# EAGLE design ENC28J60[2] (EAGLE 9.5.2)
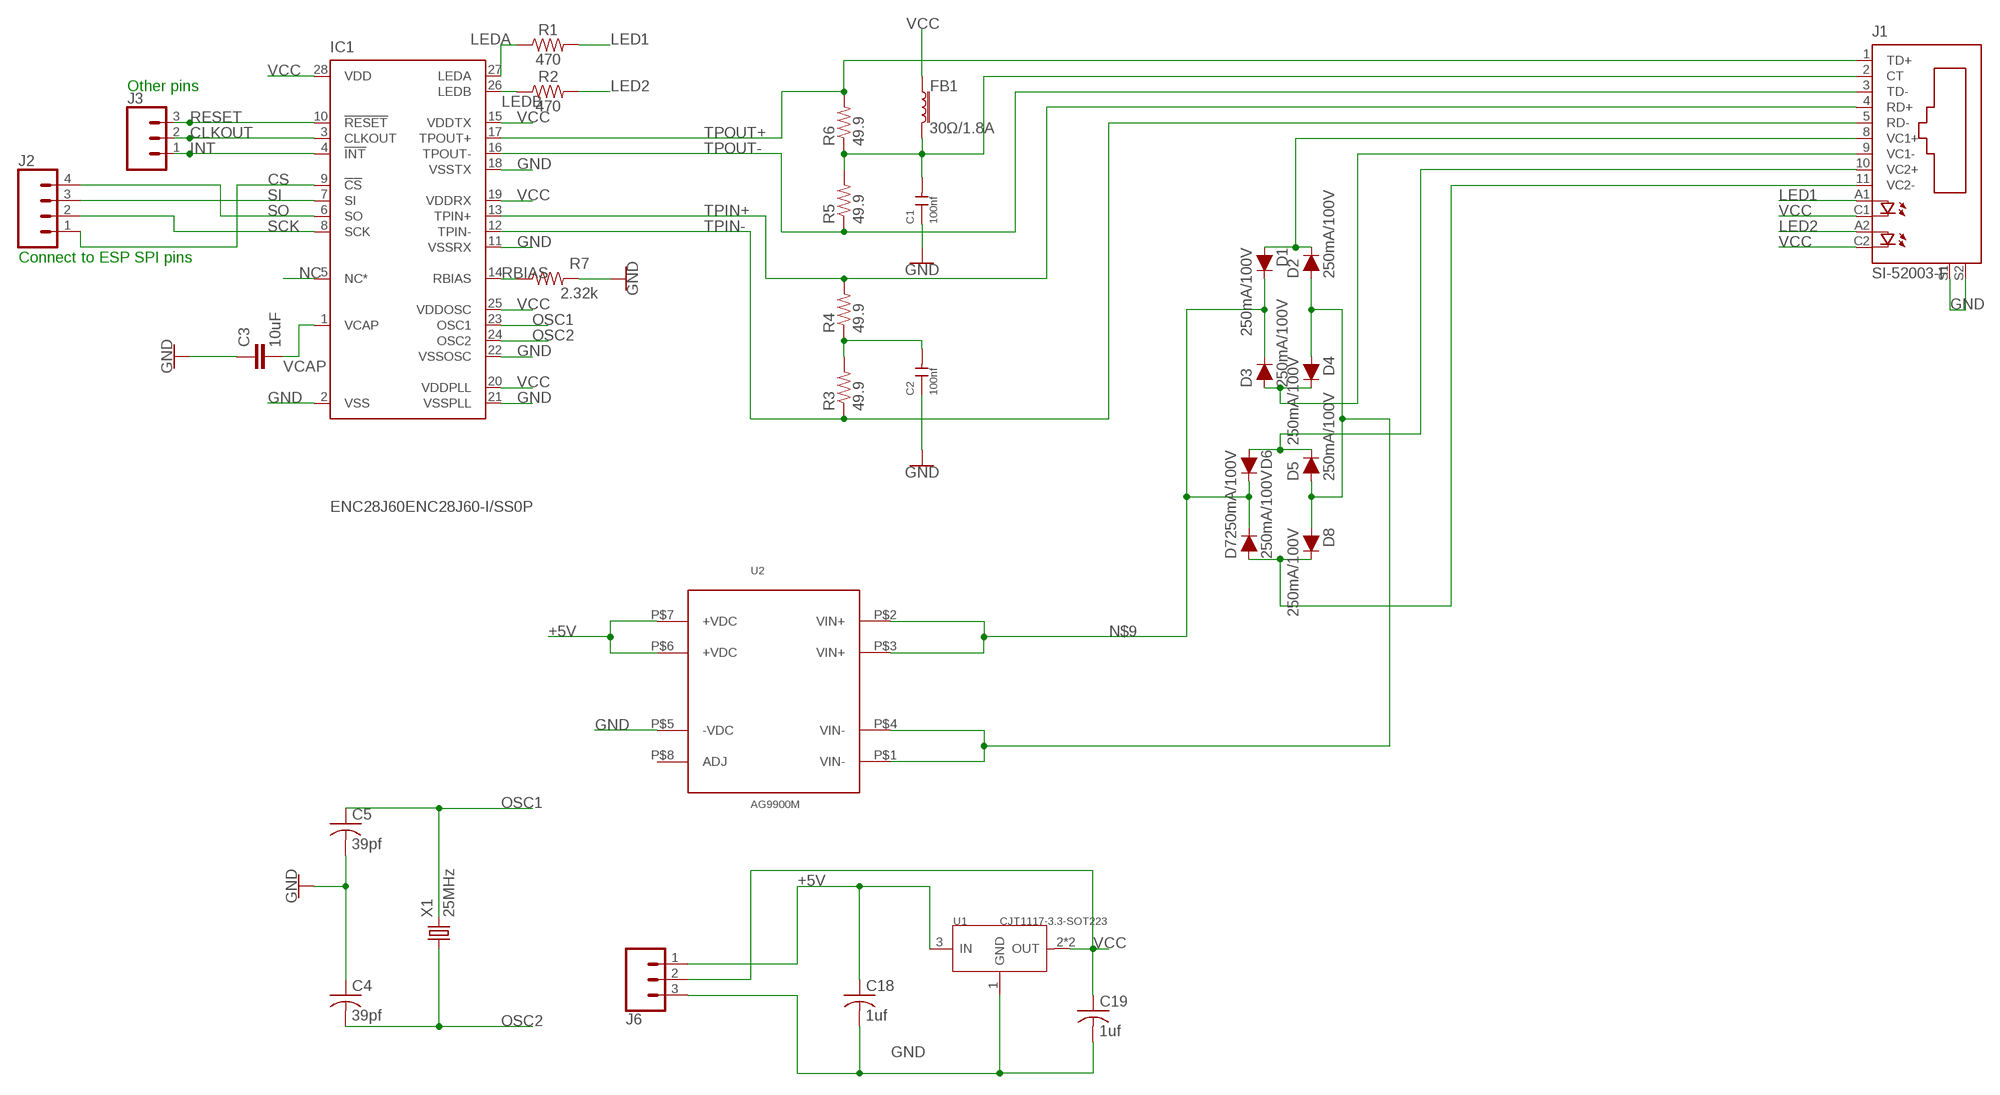
[diagram p0: schematic, sheet 1]

## Parts
C1  100nf  CERAMIC-100NF-50V-10%-X7R(0603)  [C0603]
C2  100nf  CERAMIC-100NF-50V-10%-X7R(0603)  [C0603]
C3  10uF  10UF-0805-10V-10%  [0805]
C4  39pf  C-USC0402  [C0402]
C5  39pf  C-USC0402  [C0402]
C18  1uf  C-USC0402  [C0402]
C19  1uf  C-USC0402  [C0402]
D1  250mA/100V  DIODE-BAS16J  [SOD-323]
D2  250mA/100V  DIODE-BAS16J  [SOD-323]
D3  250mA/100V  DIODE-BAS16J  [SOD-323]
D4  250mA/100V  DIODE-BAS16J  [SOD-323]
D5  250mA/100V  DIODE-BAS16J  [SOD-323]
D6  250mA/100V  DIODE-BAS16J  [SOD-323]
D7  250mA/100V  DIODE-BAS16J  [SOD-323]
D8  250mA/100V  DIODE-BAS16J  [SOD-323]
FB1  30Ω/1.8A  FERRITE_BEAD-0603  [0603]
IC1  ENC28J60ENC28J60-I/SS0P  [SOP65P780X200-28]
J1  SI-52003-F  [SI-52003-F]
J2  CONN_04  [1X04]
J3  CONN_03  [1X03]
J6  CONN_03  [1X03]
R1  470  470OHM-0603-1/10W-1%  [0603]
R2  470  470OHM-0603-1/10W-1%  [0603]
R3  49.9  R-US_M0805  [M0805]
R4  49.9  R-US_M0805  [M0805]
R5  49.9  R-US_M0805  [M0805]
R6  49.9  R-US_M0805  [M0805]
R7  2.32k  2.2KOHM-0603-1/10W-1%  [0603]
U1  CJT1117-3.3-SOT223  PMIC-CJT1117-3.3(SOT223)  [SOT-223]
U2  AG9900M  [AG9900M/MT]
X1  25MHz  49S-25-20-2049S-25-20-20  [XTALRR488W48L1067T422H350B]

## Nets
+5V: C18.1 J6.1 U1.3(IN) U2.P$6(+VDC) U2.P$7(+VDC)
CLKOUT: IC1.3(CLKOUT) J3.2
CS: IC1.9(!CS) J2.1
GND: C1.1 C2.1 C3.1 C4.1 C5.2 C18.2 C19.2 IC1.2(VSS) IC1.11(VSSRX) IC1.18(VSSTX) IC1.21(VSSPLL) IC1.22(VSSOSC) J1.S1 J1.S2 J6.3 R7.2 U1.1(GND) U2.P$5(-VDC)
INT: IC1.4(!INT) J3.1
LED1: J1.A1 R1.2
LED2: J1.A2 R2.2
LEDA: IC1.27(LEDA) R1.1
LEDB: IC1.26(LEDB) R2.1
N$1: D3.A D4.C J1.9(VC1-)
N$2: D7.A D8.C J1.11(VC2-)
N$3: C1.2 FB1.2 J1.2(CT) R5.2 R6.1
N$7: D1.A D2.C J1.8(VC1+)
N$9: D1.C D3.C D6.C D7.C U2.P$2(VIN+) U2.P$3(VIN+)
N$15: D5.C D6.A J1.10(VC2+)
N$18: C2.2 R3.2 R4.1
N$39: D2.A D4.A D5.A D8.A U2.P$1(VIN-) U2.P$4(VIN-)
NC: IC1.5(NC*)
OSC1: C5.1 IC1.23(OSC1) X1.2
OSC2: C4.2 IC1.24(OSC2) X1.1
RBIAS: IC1.14(RBIAS) R7.1
RESET: IC1.10(!RESET) J3.3
SCK: IC1.8(SCK) J2.2
SI: IC1.7(SI) J2.3
SO: IC1.6(SO) J2.4
TPIN+: IC1.13(TPIN+) J1.4(RD+) R4.2
TPIN-: IC1.12(TPIN-) J1.5(RD-) R3.1
TPOUT+: IC1.17(TPOUT+) J1.1(TD+) R6.2
TPOUT-: IC1.16(TPOUT-) J1.3(TD-) R5.1
VCAP: C3.2 IC1.1(VCAP)
VCC: C19.1 FB1.1 IC1.15(VDDTX) IC1.19(VDDRX) IC1.20(VDDPLL) IC1.25(VDDOSC) IC1.28(VDD) J1.C1 J1.C2 J6.2 U1.2(OUT) U1.TER(OUT)
Unconnected: U2.P$8(ADJ)

## Notes on the sheet
- Other pins
- Connect to ESP SPI pins

## Library data of the parts
C1 C2 = OPL_Capacitor:CERAMIC-100NF-50V-10%-X7R(0603): 302010138; MPN: CC0603KRX7R9BB104
C3 = SparkFun-Capacitors:10UF: 10.0µF ceramic capacitors A capacitor is a passive two-terminal electrical component used to store electrical energy temporarily in an electric field.; PROD_ID: CAP-11330
C4 C5 C18 C19 = BeagleBone_Black_Wireless:C-US: CAPACITOR, American symbol
D1-D8 = SparkFun-DiscreteSemi:DIODE: Diode These are standard reverse protection diodes and small signal diodes. SparkFun Products: SparkFun SparkPunk Sound Kit <https://www.sparkfun.com/products/11177> SparkFun ESP8266 Thing <https://www.sparkfun.com/products/13231>; PROD_ID: DIO-09646
FB1 = SparkFun-Coils:FERRITE_BEAD: Ferrite Bead (blocks, cores, rings, chokes, etc.) Inductor with layers of ferrite used to suppress high frequencies. Often used to isolate high frequency noise. SparkFun Products: IOIO-OTG - V2.2 <https://www.sparkfun.com/products/13613> SparkFun SAMD21 Mini Breakout <https://www.sparkfun.com/products/13664> SparkFun 6 Degrees of Freedom Breakout - LSM6DS3 <https://www.sparkfun.com/products/13339> SparkFun SAMD21 Dev Breakout <https://www.sparkfun.com/products/13672>; PROD_ID: NDUC-07859
IC1 = ENC28J60QFN:ENC28J60: Stand-Alone Ethernet Controller with SPI Interface Source: http://ww1.microchip.com/downloads/en/DeviceDoc/39662c.pdf
J1 = SI-52003-F:SI-52003-F: Ethernet Connector MagJack (R) Source: www.stewartconnector.com .. si-50170.pdf; AVAILABILITY: Unavailable; DESCRIPTION: Conn RJ-45 F 8 POS Solder RA Thru-Hole 12 Terminal 1 Port; MF: Stewart Connector; MP: SI-52003-F; PACKAGE: None; PRICE: None
J2 = SparkFun-Connectors:CONN_04: Multi connection point. Often used as Generic Header-pin footprint for 0.1 inch spaced/style header connections On any of the 0.1 inch spaced packages, you can populate with these: Break Away Headers - Straight <https://www.sparkfun.com/products/116> (PRT-00116) Break Away Male Headers - Right Angle <https://www.sparkfun.com/products/553> (PRT-00553) Female Headers <https://www.sparkfun.com/products/115> (PRT-00115) Break Away Headers - Machine Pin <https://www.sparkfun.com/products/117> (PRT-00117) Break Away Female Headers - Swiss Machine Pin <https://www.sparkfun.com/products/743> (PRT-00743) For SCREWTERMINALS and SPRING TERMINALS visit here: Screw Terimnals on SparkFun.com <https://www.sparkfun.com/search/results?term=Screw+Terminals> (5mm/3.5mm/2.54mm spacing) This device is also useful as a general connection point to wire up your design to another part of your project. Our various solder wires solder well into these plated through hole pads. Hook-Up Wire - Assortment (Stranded, 22 AWG) <https://www.sparkfun.com/products/11375> (PRT-11375) Hook-Up Wire - Assortment (Solid Core, 22 AWG) <https://www.sparkfun.com/products/11367> (PRT-11367) View the entire wire category on our website here <https://www.sparkfun.com/categories/141> Special notes: Molex polarized connector foot print use with SKU : PRT-08231 with associated crimp pins and housings. 1MM SMD Version SKU: PRT-10208; PROD_ID: CONN-09696
J3 J6 = SparkFun-Connectors:CONN_03: Multi connection point. Often used as Generic Header-pin footprint for 0.1 inch spaced/style header connections On any of the 0.1 inch spaced packages, you can populate with these: Break Away Headers - Straight <https://www.sparkfun.com/products/116> (PRT-00116) Break Away Male Headers - Right Angle <https://www.sparkfun.com/products/553> (PRT-00553) Female Headers <https://www.sparkfun.com/products/115> (PRT-00115) Break Away Headers - Machine Pin <https://www.sparkfun.com/products/117> (PRT-00117) Break Away Female Headers - Swiss Machine Pin <https://www.sparkfun.com/products/743> (PRT-00743) Stackable Header - 3 Pin (Female, 0.1") <https://www.sparkfun.com/products/13875> (PRT-13875) For SCREWTERMINALS and SPRING TERMINALS visit here: Screw Terimnals on SparkFun.com <https://www.sparkfun.com/search/results?term=Screw+Terminals> (5mm/3.5mm/2.54mm spacing) This device is also useful as a general connection point to wire up your design to another part of your project. Our various solder wires solder well into these plated through hole pads. Hook-Up Wire - Assortment (Stranded, 22 AWG) <https://www.sparkfun.com/products/11375> (PRT-11375) Hook-Up Wire - Assortment (Solid Core, 22 AWG) <https://www.sparkfun.com/products/11367> (PRT-11367) View the entire wire category on our website here <https://www.sparkfun.com/categories/141> Special notes: Molex polarized connector foot print use with SKU : PRT-08232 with associated crimp pins and housings.
R1 R2 = SparkFun-Resistors:470OHM: 470Ω resistor A resistor is a passive two-terminal electrical component that implements electrical resistance as a circuit element. Resistors act to reduce current flow, and, at the same time, act to lower voltage levels within circuits. - Wikipedia; PROD_ID: RES-07869
R3-R6 = BeagleBone_Black_Wireless:R-US_: RESISTOR, American symbol
R7 = SparkFun-Resistors:2.2KOHM: 2.2kΩ resistor A resistor is a passive two-terminal electrical component that implements electrical resistance as a circuit element. Resistors act to reduce current flow, and, at the same time, act to lower voltage levels within circuits. - Wikipedia; PROD_ID: RES-08272; VALUE: 2.2k
U1 = OPL_IC:PMIC-CJT1117-3.3(SOT223): 310030097; MPN: CJT1117-3.3
U2 = AG9900M:AG9900M
X1 = IQD-Frequency-Products:49S-25-20-20

## Board
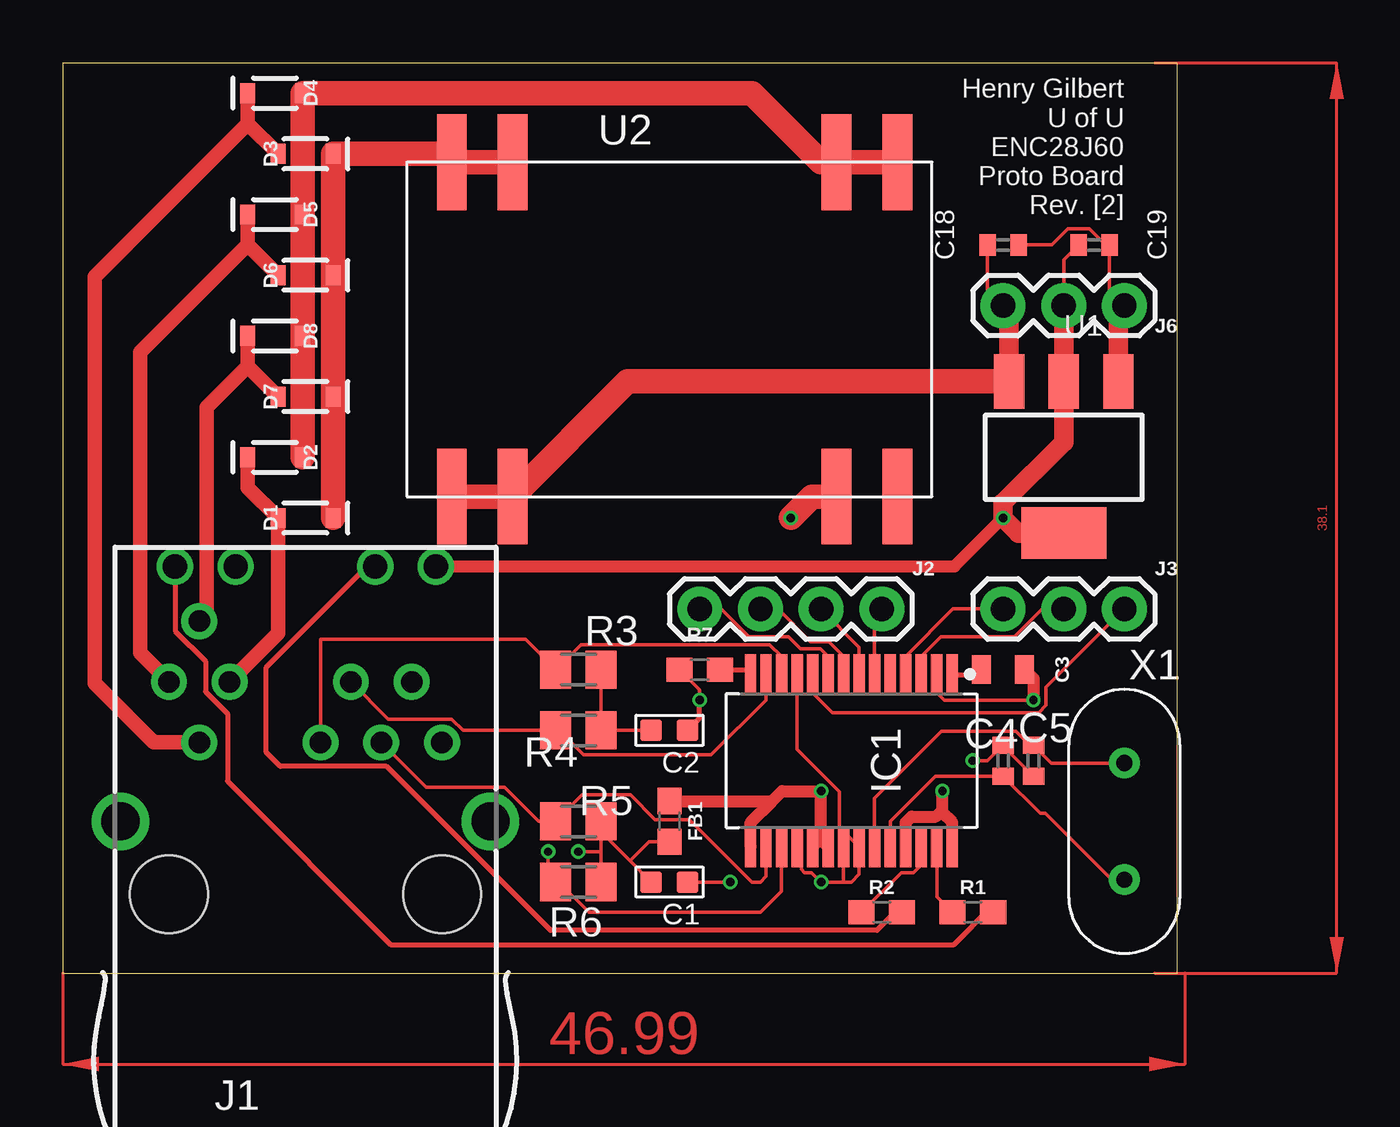
[diagram p1: board, top side]
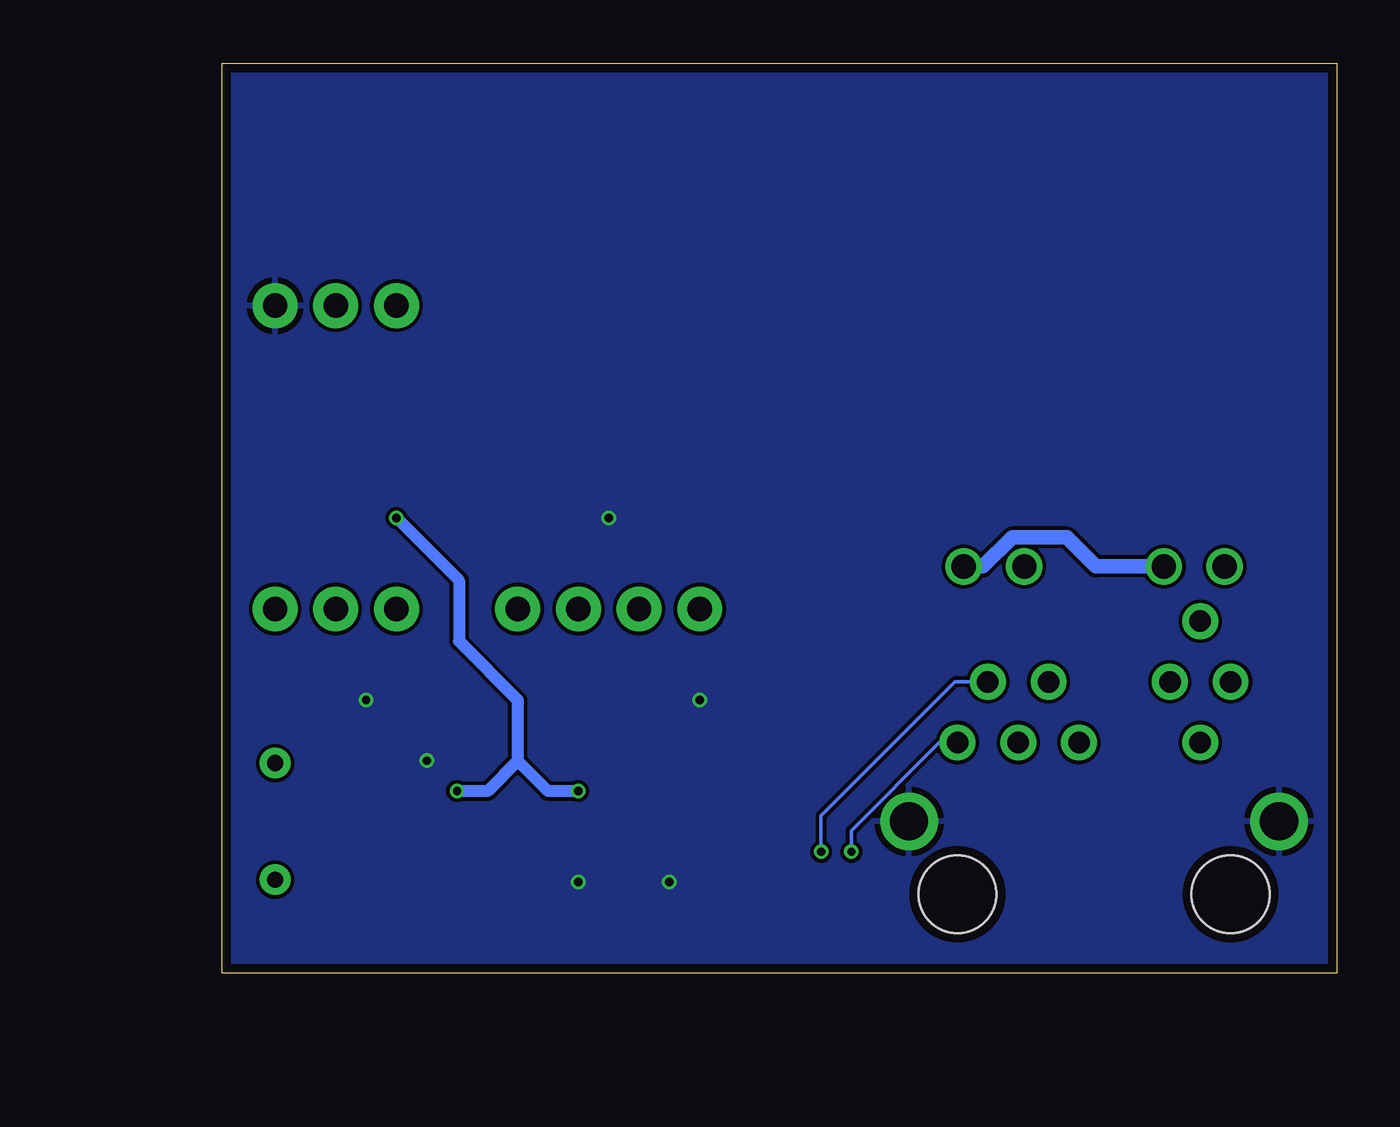
[diagram p2: board, bottom side, seen from below]

Size 46.66 x 38.09 mm. Coordinates in mm from the lower left corner, seen from the top.
Outline: 0,0 46.66,0 46.66,38.09 0,38.09 0,0
Copper layers (1*16): Top 0.035559375mm / dielectric 1.6mm / Bottom 0.035559375mm
Design rules "oshpark": minimum track width 6mil, minimum drill 10mil, track to track 6mil, track to pad 6mil, pad to pad 6mil, via to via 6mil, smd to smd 6mil, copper to edge 15mil, drill to drill 6mil, minimum pad ring 5mil, minimum via ring 5mil, stop-mask expansion 2.5mil, vias tented up to drill 0mil, thermal gap 10mil

### Footprints (pad centres in the part's own frame; a part is rotated, then mirrored left to right if it is on the bottom)
C0603 = smd 0.889 x 0.889: 1 0,0.762; 2 0,-0.762
0805 = smd 0.8 x 1.2: 1 -0.9,0; 2 0.9,0
C0402 = smd 0.7 x 0.9: 1 -0.65,0; 2 0.65,0
SOD-323 = smd 0.63 x 0.83: A 1.15,0; C -1.15,0
0603 = smd 1.1 x 1: 1 -0.85,0; 2 0.85,0
SOP65P780X200-28 = smd 1.702 x 0.475: 1 -3.603,4.225; 2 -3.603,3.575; 3 -3.603,2.925; 4 -3.603,2.275; 5 -3.603,1.625; 6 -3.603,0.975; 7 -3.603,0.325; 8 -3.603,-0.325; 9 -3.603,-0.975; 10 -3.603,-1.625; 11 -3.603,-2.275; 12 -3.603,-2.925; 13 -3.603,-3.575; 14 -3.603,-4.225; 15 3.603,-4.225; 16 3.603,-3.575; 17 3.603,-2.925; 18 3.603,-2.275; 19 3.603,-1.625; 20 3.603,-0.975; 21 3.603,-0.325; 22 3.603,0.325; 23 3.603,0.975; 24 3.603,1.625; 25 3.603,2.275; 26 3.603,2.925; 27 3.603,3.575; 28 3.603,4.225
SI-52003-F = drill 0.9 pad 1.5: 1 5.715,3.302; 2 4.445,5.842; 3 3.175,3.302; 4 1.905,5.842; 5 0.635,3.302; 8 -3.175,5.842; 9 -4.445,3.302; 10 -5.715,5.842; 11 -4.445,8.382 | drill 1.016 pad 1.5: A1 -5.461,10.668; A2 2.921,10.668; C1 -2.921,10.668; C2 5.461,10.668 | drill 1.6 pad 2.2: S1 -7.747,0; S2 7.747,0 | hole 3.251: -5.715,-3.048; 5.715,-3.048
1X04 = drill 1.016 pad 1.88: 1 0,0; 2 2.54,0; 3 5.08,0; 4 7.62,0
1X03 = drill 1.016 pad 1.88: 1 0,0; 2 2.54,0; 3 5.08,0
M0805 = smd 1.3 x 1.6: 1 -0.95,0; 2 0.95,0
SOT-223 = smd 1.27 x 2.286: 1 -2.286,-3.175; 2 0,-3.175; 3 2.286,-3.175 | smd 3.556 x 2.159: TER 0,3.175
AG9900M/MT = smd 1.25 x 4: P$1 7,6; P$2 -6.57,6; P$3 -9.11,6; P$4 9.54,6; P$5 7,-8; P$6 -6.57,-8; P$7 -9.11,-8; P$8 9.54,-8
XTALRR488W48L1067T422H350B = drill 0.68 pad 1.28: 1 -2.44,0; 2 2.44,0

### Placement (x,y rotation side)
C1  25.4,3.81 270 top
C2  25.4,10.16 270 top
C3  39.37,12.7 180 top
C4  39.37,8.89 270 top
C5  40.64,8.89 270 top
C18  39.37,30.48 0 top
C19  43.18,30.48 0 top
D1  10.16,19.05 180 top
D2  8.89,21.59 0 top
D3  10.16,34.29 180 top
D4  8.89,36.83 0 top
D5  8.89,31.75 0 top
D6  10.16,29.21 180 top
D7  10.16,24.13 180 top
D8  8.89,26.67 0 top
FB1  25.4,6.35 270 top
IC1  33.02,8.89 270 top
J1  10.16,6.35 0 top
J2  26.67,15.24 0 top
J3  39.37,15.24 0 top
J6  39.37,27.94 0 top
R1  38.1,2.54 0 top
R2  34.29,2.54 0 top
R3  21.59,12.7 0 top
R4  21.59,10.16 180 top
R5  21.59,6.35 0 top
R6  21.59,3.81 180 top
R7  26.67,12.7 180 top
U1  41.91,21.59 180 top
U2  25.4,27.94 0 top
X1  44.45,6.35 90 top

### Tracks (layer width: path | path; a pad name or v marks a point on that pad's centre or on a via)
+5V
  Top 0.152: J6.1 38.72,28.59 C18.1
  Top 0.813: U1.3 39.62,27.69 J6.1
  Top 1.016: U2.P$7 U2.P$6 23.66,24.77 U1.3
CLKOUT
  Top 0.152: J3.2 41.02,15.24 39.85,14.07 36.76,14.07 35.95,13.26 IC1.3
CS
  Top 0.152: J2.1 27.56,15.24 28.73,14.07 30.38,14.07 30.88,13.57 31.73,13.57 32.05,13.26 IC1.9
GND  (via drill 0.35)
  Top 0.152: v27.94,3.81 C1.1 | IC1.18 30.93,5.1 30.93,4.34 31.06,4.21 31.35,4.21 v31.75,3.81 32.7,3.81 | IC1.21 32.7,3.81 | 32.7,3.81 33.02,3.81 33.34,4.13 IC1.22 32.7,5.94 IC1.21 | C5.2 39.37,9.51 C4.1 38.72,8.89 v38.1,8.89 | R7.2 26.67,11.85 v26.67,11.43 | IC1.21 32.53,5.46 32.53,7.59 30.75,9.38 IC1.11 | v40.64,11.43 40.62,11.41 36.91,11.41 36.59,11.73 IC1.2 | C18.2 41.41,30.48 42.09,31.16 42.98,31.16 43.65,30.48 C19.2 43.83,28.56 J6.3
  Top 0.2: C2.1 26.67,10.67 v26.67,11.43
  Top 0.508: C3.1 40.64,12.33 v40.64,11.43
  Top 0.813: U1.1 44.2,27.69 J6.3
  Top 1.016: v30.48,19.05 31.37,19.94 U2.P$5
  pour Bottom: 0,38.1 46.99,38.1 46.99,0 0,0
INT
  Top 0.152: J3.1 37.28,15.24 35.3,13.26 IC1.4
LED1
  Top 0.152: R1.2 39.16,2.75
  Top 0.203: 39.16,2.75 38.87,2.75 37.31,1.19 13.73,1.19 6.89,8.03 6.89,10.86 5.98,11.78 5.98,13.05 4.71,14.32 4.71,17.01 J1.A1
LED2
  Top 0.203: R2.2 34.85,2.54 34.09,1.79 20.41,1.79 13.55,8.65 9.11,8.65 8.52,9.24 8.52,12.8 12.74,17.02 J1.A2
LEDA
  Top 0.152: R1.1 36.59,3.19 IC1.27
LEDB
  Top 0.152: R2.1 35.11,4.21 35.63,4.21 35.95,4.53 IC1.26
N$1
  Top 0.61: D3.A 7.74,35.56 | 7.74,35.56 D4.C | J1.9 3.81,9.65 1.33,12.13 1.33,29.15 7.74,35.56
N$2
  Top 0.61: D7.A 7.74,25.4 | D8.C 7.74,25.4 | J1.11 6.02,15.04 6.02,23.68 7.74,25.4
N$3  (via drill 0.35)
  Top 0.152: C1.2 23.75,4.7 | 23.75,4.7 22.54,5.91 R5.2 22.54,5.08 | 22.54,5.08 R6.1 | 22.54,5.08 v21.59,5.08 | 23.75,4.7 24.55,5.5 FB1.2
  Bottom 0.152: J1.2 15.99,12.19 21.59,6.59 v21.59,5.08
N$7
  Top 0.61: D2.C 7.74,20.32 D1.A 9.01,14.22 J1.8
N$9
  Top 1.016: U2.P$2 U2.P$3 15.94,34.29 D3.C D6.C D7.C D1.C
N$15
  Top 0.61: D6.A 7.74,30.48 | 7.74,30.48 D5.C | J1.10 3.24,13.4 3.24,25.98 7.74,30.48
N$18
  Top 0.152: R3.2 R4.1 C2.2
N$39
  Top 1.016: U2.P$4 U2.P$1 31.75,33.94 28.86,36.83 D4.A D5.A D8.A D2.A
OSC1
  Top 0.152: IC1.23 33.99,7.33 36.79,10.12 39.91,10.12 40.49,9.54 C5.1 41.39,8.79 X1.2
OSC2
  Top 0.152: IC1.24 34.65,6.35 36.53,8.24 C4.2 40.92,6.69 41.15,6.69 43.92,3.91 X1.1
RBIAS
  Top 0.2: R7.1 28.59,12.7 IC1.14
RESET
  Top 0.152: IC1.10 31.39,11.73 32.23,10.9 40.86,10.9 41.17,11.21 41.17,11.96 J3.3
SCK
  Top 0.152: J2.2 29.95,15.24 31.31,13.88 32.07,13.88 32.7,13.26 IC1.8
SI
  Top 0.152: J2.3 33.34,13.64 IC1.7
SO
  Top 0.152: IC1.6 33.99,14.95 J2.4
TPIN+
  Top 0.152: IC1.13 29.45,11.43 27.15,9.13 21.8,9.13 20.77,10.16 R4.2 16.75,10.16 16.28,10.63 13.63,10.63 J1.4
TPIN-
  Top 0.152: IC1.12 30.09,13.26 29.6,13.75 21.69,13.75 R3.1 19.37,13.97 10.79,13.97 J1.5
TPOUT+  (via drill 0.35)
  Top 0.152: IC1.17 30.09,3.42 29.21,2.54 22.04,2.54 20.77,3.81 R6.2 20.32,4.13 v20.32,5.08
  Bottom 0.152: v20.32,5.08 20.32,5.96 16.62,9.65 J1.1
TPOUT-
  Top 0.152: IC1.16 29.45,4.04 29.21,3.81 28.86,3.81 26.25,6.42 24.8,6.42 23.77,7.46 21.75,7.46 R5.1 19.93,6.35 18.5,7.78 15.21,7.78 J1.3
VCAP
  Top 0.2: IC1.1 38.26,12.49 C3.2
VCC  (via drill 0.35)
  Top 0.152: C19.1 41.91,29.86 J6.2
  Top 0.508: IC1.20 31.75,5.58 | 31.75,5.58 v31.75,7.62 30.11,7.62 29.7,7.2 | IC1.19 31.69,5.58 31.75,5.58 | IC1.15 28.8,6.31 29.7,7.2 | IC1.25 35.3,6.31 35.54,6.54 36.55,6.54 36.83,6.82 v36.83,7.62 36.83,6.71 37.24,6.31 37.24,5.29 IC1.28 | FB1.1 29.7,7.2 | v39.37,19.05 37.34,17.02 J1.C2
  Top 0.813: J6.2 U1.2 41.91,22.23 39.37,19.68 v39.37,19.05 40.01,18.41 U1.TER
  Bottom 0.508: 34.29,8.89 34.29,11.43 36.75,13.89 36.75,16.43 v39.37,19.05 | 34.29,8.89 35.56,7.62 v36.83,7.62 | v31.75,7.62 33.02,7.62 34.29,8.89
  Bottom 0.61: J1.C1 10.09,17.02 11.31,18.24 13.59,18.24 14.8,17.02 J1.C2
(copper drawn outside any net)
  shapes: Top area x2

### Text on the board
tNames: Henry Gilbert / U of U / ENC28J60 / Proto Board / Rev. [2]
silk_top: ENC28J60 / Proto-Board / Rev 1 | CS | SCK | SI | SO | INT | CLKOUT | RESET